# EAGLE schematic holo (EAGLE 6.1)

## Sheet 1 of 6
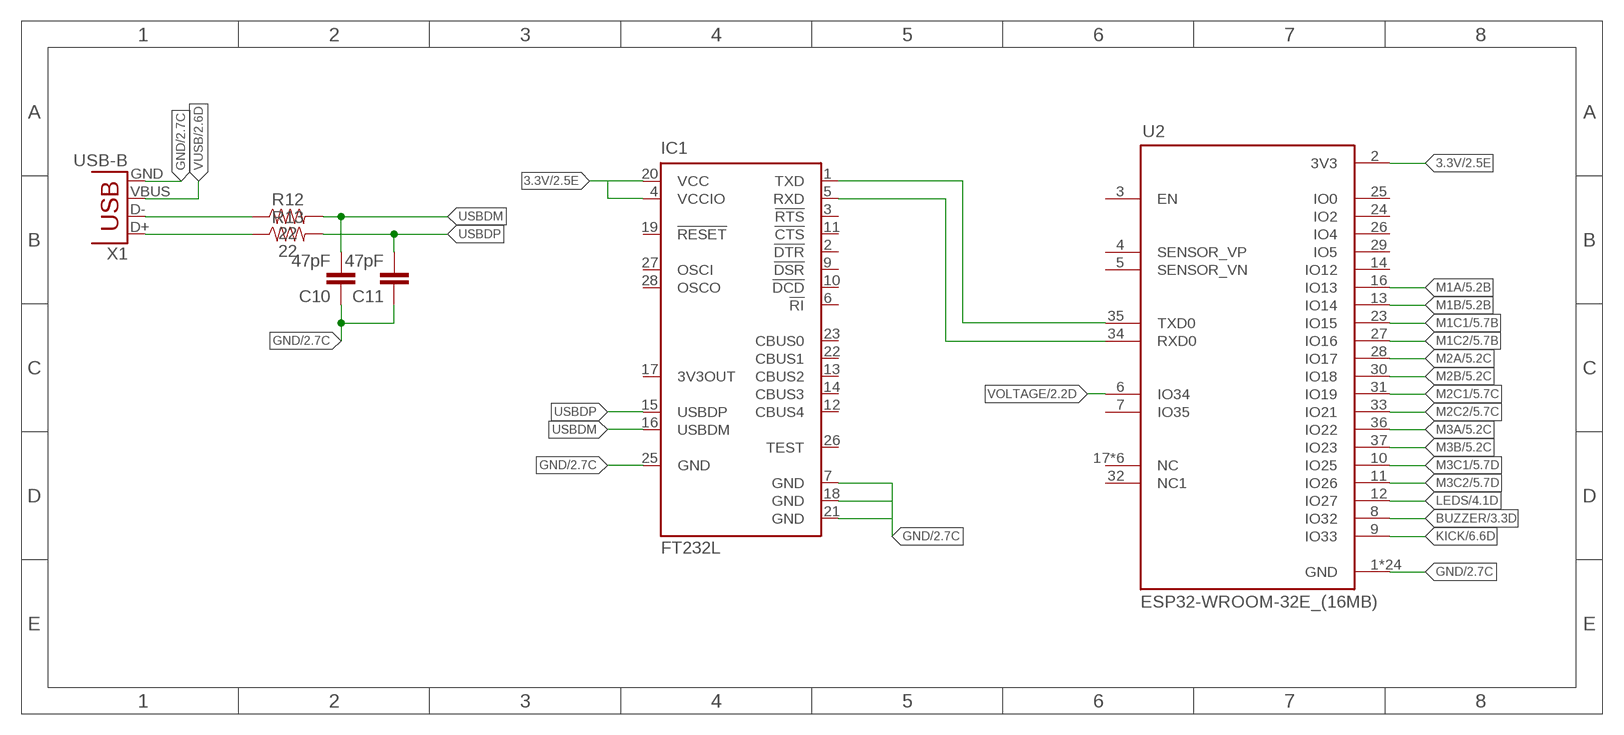
[diagram p0: schematic, sheet 1]

### Parts
C10  47pF  CAP0805  [0805]
C11  47pF  CAP0805  [0805]
IC1  FT232L  [SSOP28]
R12  22  0.3OHM-0805-1/8W-1%  [0805]
R13  22  0.3OHM-0805-1/8W-1%  [0805]
U2  ESP32-WROOM-32E_(16MB)  [MODULE_ESP32-WROOM-32E_(16MB)]
X1  USB-B  USBPTH  [USB-B-PTH]

### Nets
3.3V: IC1.4(VCCIO) IC1.20(VCC) U2.2(3V3) ; also sheet 2
BUZZER: U2.8(IO32) ; also sheet 3
GND [bigalime]: C10.1 C11.1 IC1.7(GND) IC1.18(GND) IC1.21(GND) IC1.25(GND) U2.1(GND) U2.15(GND) U2.38(GND) U2.39_1(GND) U2.39_2(GND) U2.39_3(GND) U2.39_4(GND) U2.39_5(GND) U2.39_6(GND) U2.39_7(GND) U2.39_8(GND) U2.39_9(GND) U2.39_10(GND) U2.39_11(GND) U2.39_12(GND) U2.39_13(GND) U2.39_14(GND) U2.39_15(GND) U2.39_16(GND) U2.39_17(GND) U2.39_18(GND) U2.39_19(GND) U2.39_20(GND) U2.39_21(GND) X1.GND ; also sheet 2,3,4,5,6
KICK: U2.9(IO33) ; also sheet 6
LEDS: U2.12(IO27) ; also sheet 4
M1A: U2.16(IO13) ; also sheet 5
M1B: U2.13(IO14) ; also sheet 5
M1C1: U2.23(IO15) ; also sheet 5
M1C2: U2.27(IO16) ; also sheet 5
M2A: U2.28(IO17) ; also sheet 5
M2B: U2.30(IO18) ; also sheet 5
M2C1: U2.31(IO19) ; also sheet 5
M2C2: U2.33(IO21) ; also sheet 5
M3A: U2.36(IO22) ; also sheet 5
M3B: U2.37(IO23) ; also sheet 5
M3C1: U2.10(IO25) ; also sheet 5
M3C2: U2.11(IO26) ; also sheet 5
N$14: IC1.1(TXD) U2.35(TXD0)
N$15: IC1.5(RXD) U2.34(RXD0)
N$59: R12.1 X1.D-
N$60: R13.1 X1.D+
USBDM: C10.2 IC1.16(USBDM) R12.2
USBDP: C11.2 IC1.15(USBDP) R13.2
VOLTAGE: U2.6(IO34) ; also sheet 2
VUSB: X1.VBUS ; also sheet 2
Unconnected: IC1.2(!DTR) IC1.3(!RTS) IC1.6(!RI) IC1.9(!DSR) IC1.10(!DCD) IC1.11(!CTS) IC1.12(CBUS4) IC1.13(CBUS2) IC1.14(CBUS3) IC1.17(3V3OUT) IC1.19(!RESET) IC1.22(CBUS1) IC1.23(CBUS0) IC1.26(TEST) IC1.27(OSCI) IC1.28(OSCO) U2.3(EN) U2.4(SENSOR_VP) U2.5(SENSOR_VN) U2.7(IO35) U2.14(IO12) U2.17(NC) U2.18(NC) U2.19(NC) U2.20(NC) U2.21(NC) U2.22(NC) U2.24(IO2) U2.25(IO0) U2.26(IO4) U2.29(IO5) U2.32(NC1)

## Sheet 2 of 6
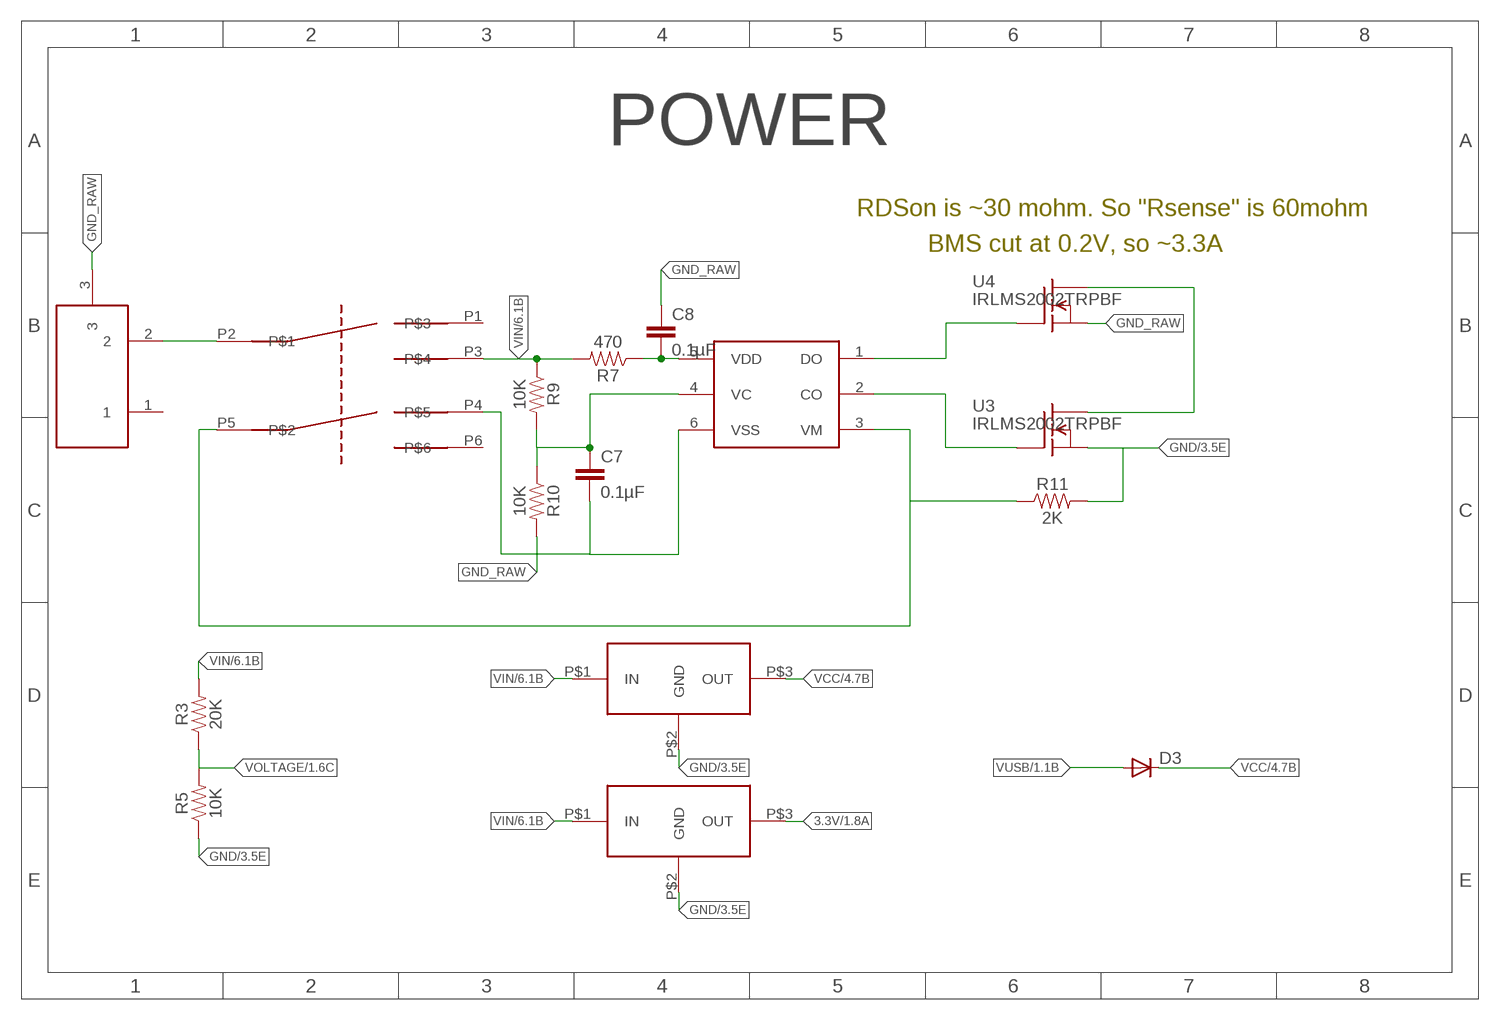
[diagram p1: schematic, sheet 2]

### Parts
C7  0.1µF  0.33UF/330NF-0805-50V-10%  [0805]
C8  0.1µF  0.33UF/330NF-0805-50V-10%  [0805]
D3  DIODESOD  [SOD-323]
R3  20K  0.3OHM-0805-1/8W-1%  [0805]
R5  10K  0.3OHM-0805-1/8W-1%  [0805]
R7  470  0.3OHM-0805-1/8W-1%  [0805]
R9  10K  0.3OHM-0805-1/8W-1%  [0805]
R10  10K  0.3OHM-0805-1/8W-1%  [0805]
R11  2K  0.3OHM-0805-1/8W-1%  [0805]
REG  REG_5V  [TRACOPOWER]
REG1  REG_5V  [TRACOPOWER]
U3  IRLMS2002TRPBF  [SOT23-6]
U4  IRLMS2002TRPBF  [SOT23-6]
U$7  S8252  [SOT23-6]
U$14  DPDT  [L202021MA04Q]
X2  DC21MMX  [DC-21MM]

### Nets
3.3V: REG1.P$3(OUT) ; also sheet 1
GND [bigalime]: R5.1 R11.2 REG1.P$2(GND) REG.P$2(GND) U3.4(S) ; also sheet 1,3,4,5,6
GND_RAW [bigalime]: C7.2 C8.1 R10.2 U4.4(S) U$7.6(VSS) U$14.P4 X2.3
N$7: U$14.P2 X2.2
N$8: C8.2 R7.1 U$7.5(VDD)
N$9: C7.1 R9.2 R10.1 U$7.4(VC)
N$10: U3.1(D) U3.2(D) U3.5(D) U3.6(D) U4.1(D) U4.2(D) U4.5(D) U4.6(D)
N$11: U3.3(G) U$7.2(CO)
N$12: U4.3(G) U$7.1(DO)
N$13: R11.1 U$7.3(VM) U$14.P5
VCC [alime]: D3.1(C) REG.P$3(OUT) ; also sheet 4
VIN [alime]: R3.2 R7.2 R9.1 REG1.P$1(IN) REG.P$1(IN) U$14.P3 ; also sheet 6
VOLTAGE: R3.1 R5.2 ; also sheet 1
VUSB: D3.2(A) ; also sheet 1
Unconnected: U$14.P1 U$14.P6

### Notes on the sheet
- POWER
- RDSon is ~30 mohm. So "Rsense" is 60mohm
- BMS cut at 0.2V, so ~3.3A

## Sheet 3 of 6
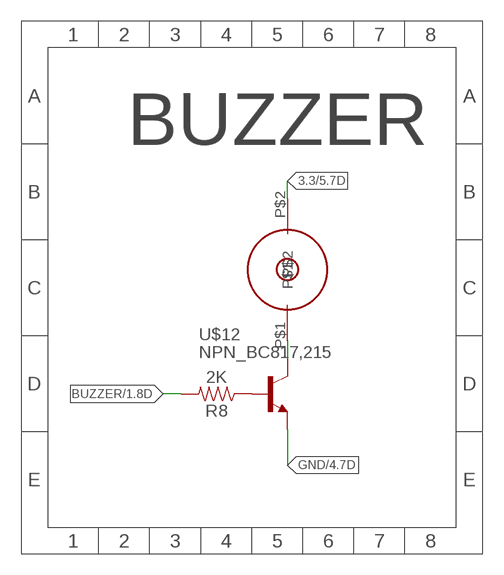
[diagram p2: schematic, sheet 3]

### Parts
R8  2K  0.3OHM-0805-1/8W-1%  [0805]
U$12  NPN_BC817,215  [SOT-23]
U$13  BUZZER66  [BUZZER66]

### Nets
3.3: U$13.P$2 ; also sheet 5
BUZZER: R8.2 ; also sheet 1
GND [bigalime]: U$12.2(E) ; also sheet 1,2,4,5,6
N$3: R8.1 U$12.1(B)
N$5: U$12.3(C) U$13.P$1

### Notes on the sheet
- BUZZER

## Sheet 4 of 6
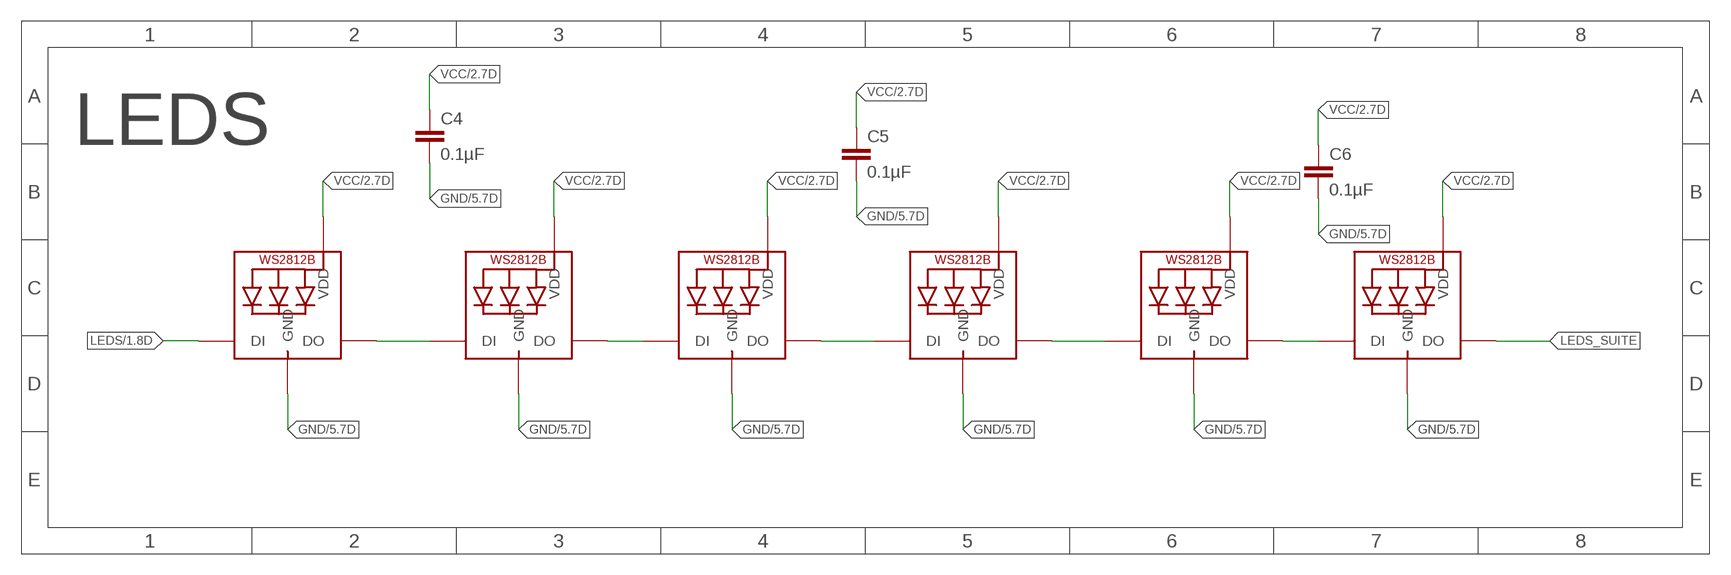
[diagram p3: schematic, sheet 4]

### Parts
C4  0.1µF  0.33UF/330NF-0805-50V-10%  [0805]
C5  0.1µF  0.33UF/330NF-0805-50V-10%  [0805]
C6  0.1µF  0.33UF/330NF-0805-50V-10%  [0805]
LED1  WS2812B5050  [WS2812B]
LED2  WS2812B5050  [WS2812B]
LED3  WS2812B5050  [WS2812B]
LED4  WS2812B5050  [WS2812B]
LED5  WS2812B5050  [WS2812B]
LED6  WS2812B5050  [WS2812B]

### Nets
GND [bigalime]: C4.2 C5.2 C6.2 LED1.3-GND(GND) LED2.3-GND(GND) LED3.3-GND(GND) LED4.3-GND(GND) LED5.3-GND(GND) LED6.3-GND(GND) ; also sheet 1,2,3,5,6
LEDS: LED1.4-DIN(DI) ; also sheet 1
LEDS_SUITE: LED6.2-DOUT(DO)
N$27: LED1.2-DOUT(DO) LED2.4-DIN(DI)
N$28: LED2.2-DOUT(DO) LED3.4-DIN(DI)
N$30: LED4.2-DOUT(DO) LED5.4-DIN(DI)
N$32: LED5.2-DOUT(DO) LED6.4-DIN(DI)
N$39: LED3.2-DOUT(DO) LED4.4-DIN(DI)
VCC [alime]: C4.1 C5.1 C6.1 LED1.1-VDD(VDD) LED2.1-VDD(VDD) LED3.1-VDD(VDD) LED4.1-VDD(VDD) LED5.1-VDD(VDD) LED6.1-VDD(VDD) ; also sheet 2

### Notes on the sheet
- LEDS

## Sheet 5 of 6
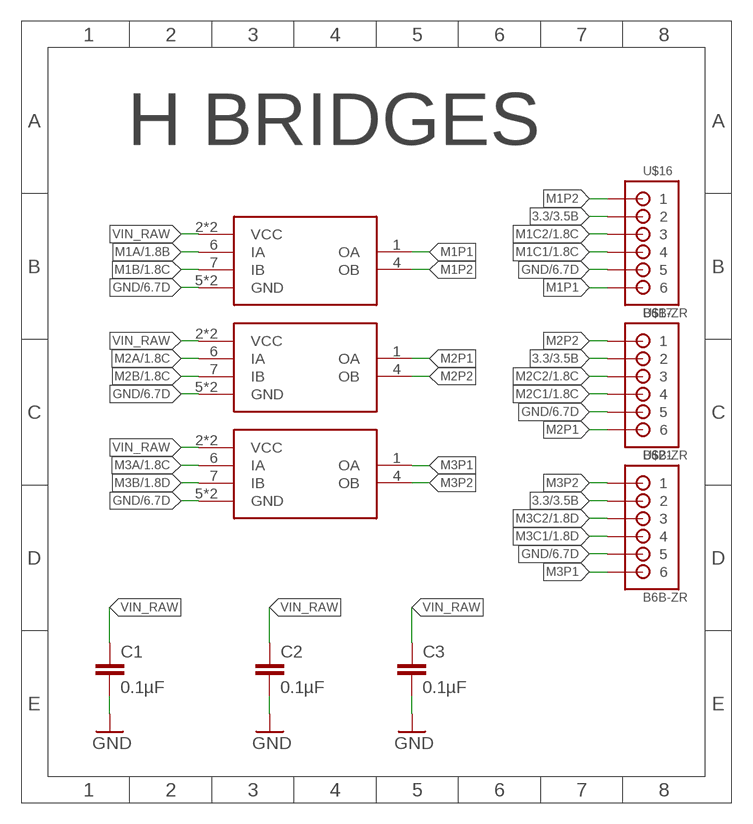
[diagram p4: schematic, sheet 5]

### Parts
C1  0.1µF  0.33UF/330NF-0805-50V-10%  [0805]
C2  0.1µF  0.33UF/330NF-0805-50V-10%  [0805]
C3  0.1µF  0.33UF/330NF-0805-50V-10%  [0805]
HB1  L9110  [SO8]
HB2  L9110  [SO8]
HB3  L9110  [SO8]
U$16  B6B-ZR  [B6B-ZR]
U$17  B6B-ZR  [B6B-ZR]
U$21  B6B-ZR  [B6B-ZR]

### Nets
3.3: U$16.2 U$17.2 U$21.2 ; also sheet 3
GND [bigalime]: C1.2 C2.2 C3.2 HB1.5(GND) HB1.8(GND) HB2.5(GND) HB2.8(GND) HB3.5(GND) HB3.8(GND) U$16.5 U$17.5 U$21.5 ; also sheet 1,2,3,4,6
M1A: HB1.6(IA) ; also sheet 1
M1B: HB1.7(IB) ; also sheet 1
M1C1: U$16.4 ; also sheet 1
M1C2: U$16.3 ; also sheet 1
M1P1 [bigalime]: HB1.1(OA) U$16.6
M1P2 [bigalime]: HB1.4(OB) U$16.1
M2A: HB2.6(IA) ; also sheet 1
M2B: HB2.7(IB) ; also sheet 1
M2C1: U$17.4 ; also sheet 1
M2C2: U$17.3 ; also sheet 1
M2P1 [bigalime]: HB2.1(OA) U$17.6
M2P2 [bigalime]: HB2.4(OB) U$17.1
M3A: HB3.6(IA) ; also sheet 1
M3B: HB3.7(IB) ; also sheet 1
M3C1: U$21.4 ; also sheet 1
M3C2: U$21.3 ; also sheet 1
M3P1 [bigalime]: HB3.1(OA) U$21.6
M3P2 [bigalime]: HB3.4(OB) U$21.1
VIN_RAW [bigalime]: C1.1 C2.1 C3.1 HB1.2(VCC) HB1.3(VCC) HB2.2(VCC) HB2.3(VCC) HB3.2(VCC) HB3.3(VCC)

### Notes on the sheet
- H BRIDGES

## Sheet 6 of 6
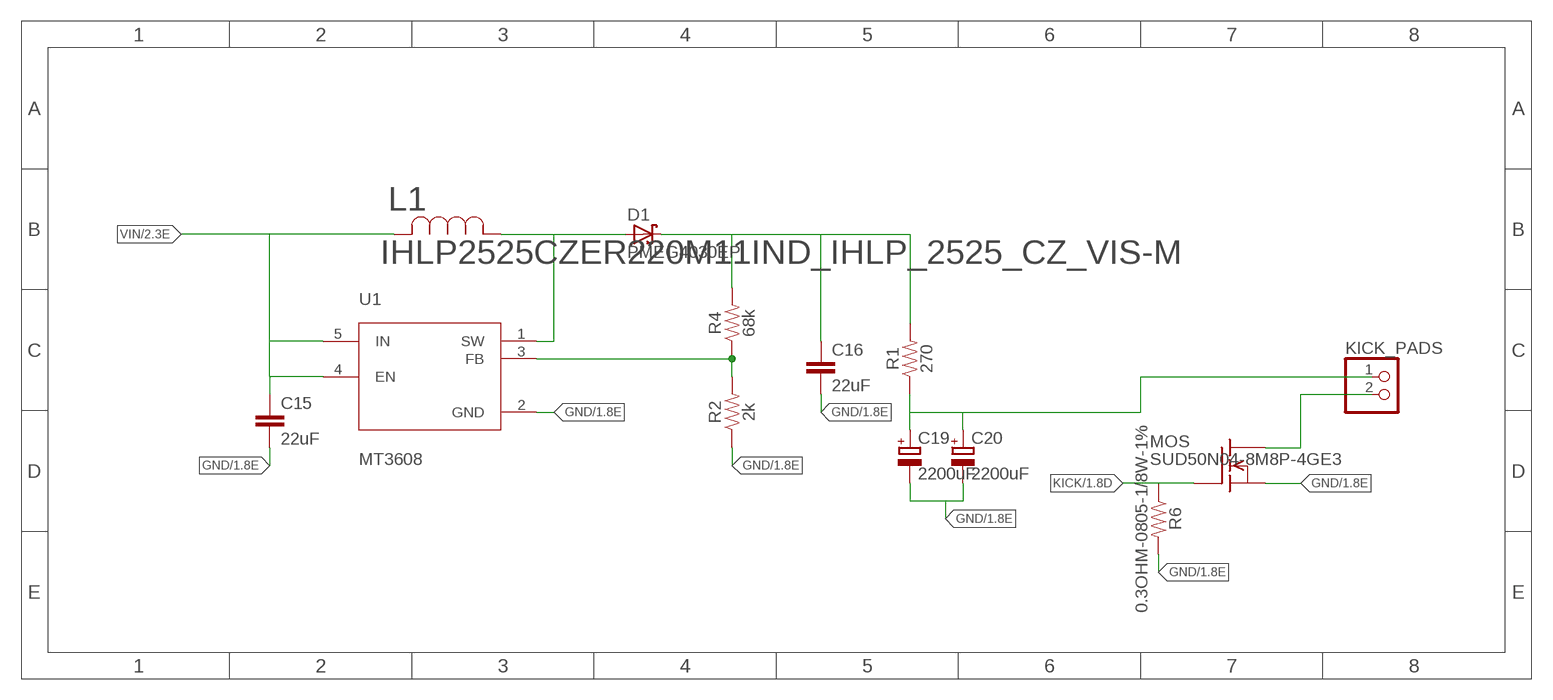
[diagram p5: schematic, sheet 6]

### Parts
C15  22uF  C-EUC0805  [C0805]
C16  22uF  C-EUC0805  [C0805]
C19  2200uF  CPOL-EUE5-13  [E5-13]
C20  2200uF  CPOL-EUE5-13  [E5-13]
D1  PMEG4030EP  [SOD128]
KICK_PADS  KICKER  [KICKER]
L1  IHLP2525CZER220M11IND_IHLP_2525_CZ_VIS-M  [IND_IHLP_2525_CZ_VIS-M]
MOS  SUD50N04-8M8P-4GE3  [TO252]
R1  270  0.3OHM-0805-1/8W-1%  [0805]
R2  2k  0.3OHM-0805-1/8W-1%  [0805]
R4  68k  0.3OHM-0805-1/8W-1%  [0805]
R6  0.3OHM-0805-1/8W-1%  [0805]
U1  MT3608  [SOT95P280X145-6N]

### Nets
GND [bigalime]: C15.2 C16.2 C19.- C20.- MOS.2(S) R2.1 R6.2 U1.2(GND) ; also sheet 1,2,3,4,5
KICK: MOS.1(G) R6.1 ; also sheet 1
KICKER: KICK_PADS.2 MOS.3(D)
N$1: D1.2(A) L1.1 U1.1(SW)
N$2: C16.1 D1.1(K) R1.2 R4.2
N$4: R2.2 R4.1 U1.3(FB)
VIN [alime]: C15.1 L1.2 U1.4(EN) U1.5(IN) ; also sheet 2
VSTORE: C19.+ C20.+ KICK_PADS.1 R1.1

## Power pins joined to a net without a drawn wire
1: X2.1

## Library data of the parts
C1-C8 = SparkFun-Capacitors:0.33UF/330NF: 0.33µF/330nF ceramic capacitors A capacitor is a passive two-terminal electrical component used to store electrical energy temporarily in an electric field.; FARNELL: 2688486RL; PROD_ID: CAP-08469; VALUE: 0.33µF
C10 C11 = SparkFun-Passives:CAP: Capacitor Standard 0603 ceramic capacitor, and 0.1" leaded capacitor.; FARNELL: 1081223
C15 C16 = resistor:C-EU: CAPACITOR, European symbol; FARNELL: 2666560
C19 C20 = rcl:CPOL-EU: POLARIZED CAPACITOR, European symbol; FARNELL: 1902893
D1 = nxp_60:PMEG4030E: 40 V, 3 A low VF MEGA Schottky barrier rectifier Planar Maximum Efficiency General Application (MEGA) Schottky barrier rectifier with an integrated guard ring for stress protection. AAL Eindhoven MK; FARNELL: 1829201
D3 = SparkFun-DiscreteSemi:DIODE: Diode These are standard reverse protection diodes and small signal diodes. SMA package can handle up to about 1A. SOD-323 can handle about 200mA. What the SOD-323 package when ordering, there are some mfgs out there that are 5-pin packages.; FARNELL: 8737843RL
HB1-HB3 = rhoban:L9110; FARNELL: L9110 SOIC8
IC1 = rhoban:FT232: Source: http://www.ftdichip.com/Documents/DataSheets/DS_FT232R_v104.pdf; DATASHEET: ft232rl.pdf; FARNELL: 1146032; FARNELL_LINK: http://fr.farnell.com/ftdi/ft232rl/usb-vers-uart-cms-ssop28-232/dp/1146032?Ntt=1146032; MPN: FT232RL; OC_FARNELL: 1146032; OC_NEWARK: 91K9918
KICK_PADS = rhoban:KICKER
L1 = INDUCTOR:IHLP2525CZER220M11; BUILT_BY: EMA_UL_Team; FARNELL: 1741369; MANUFACTURER_PART_NUMBER: IHLP2525CZER220M11; SOURCELIBRARY: Vishay_2020-02-10; VENDOR: Vishay
LED1-LED6 = adafruit:WS2812B; FARNELL: WS2812B 5050
MOS = rhoban:SUD50N04-8M8P-4GE3; FARNELL: 1794799
R1 = SparkFun-Resistors:0.3OHM: 0.3Ω resistor A resistor is a passive two-terminal electrical component that implements electrical resistance as a circuit element. Resistors act to reduce current flow, and, at the same time, act to lower voltage levels within circuits. - Wikipedia; FARNELL: 1887603; PROD_ID: RES-11622; VALUE: 0.3
R2 = SparkFun-Resistors:0.3OHM: 0.3Ω resistor A resistor is a passive two-terminal electrical component that implements electrical resistance as a circuit element. Resistors act to reduce current flow, and, at the same time, act to lower voltage levels within circuits. - Wikipedia; FARNELL: MCWR08X2001FTL; PROD_ID: RES-11622; VALUE: 0.3
R3 = SparkFun-Resistors:0.3OHM: 0.3Ω resistor A resistor is a passive two-terminal electrical component that implements electrical resistance as a circuit element. Resistors act to reduce current flow, and, at the same time, act to lower voltage levels within circuits. - Wikipedia; FARNELL: 2074395; PROD_ID: RES-11622; VALUE: 0.3
R4 = SparkFun-Resistors:0.3OHM: 0.3Ω resistor A resistor is a passive two-terminal electrical component that implements electrical resistance as a circuit element. Resistors act to reduce current flow, and, at the same time, act to lower voltage levels within circuits. - Wikipedia; FARNELL: 2447023; PROD_ID: RES-11622; VALUE: 0.3
R5 R9 R10 = SparkFun-Resistors:0.3OHM: 0.3Ω resistor A resistor is a passive two-terminal electrical component that implements electrical resistance as a circuit element. Resistors act to reduce current flow, and, at the same time, act to lower voltage levels within circuits. - Wikipedia; FARNELL: 2074334RL; PROD_ID: RES-11622; VALUE: 0.3
R6 = SparkFun-Resistors:0.3OHM: 0.3Ω resistor A resistor is a passive two-terminal electrical component that implements electrical resistance as a circuit element. Resistors act to reduce current flow, and, at the same time, act to lower voltage levels within circuits. - Wikipedia; FARNELL: 2447648; PROD_ID: RES-11622; VALUE: 0.3
R7 = SparkFun-Resistors:0.3OHM: 0.3Ω resistor A resistor is a passive two-terminal electrical component that implements electrical resistance as a circuit element. Resistors act to reduce current flow, and, at the same time, act to lower voltage levels within circuits. - Wikipedia; FARNELL: 2447662; PROD_ID: RES-11622; VALUE: 0.3
R8 R11 = SparkFun-Resistors:0.3OHM: 0.3Ω resistor A resistor is a passive two-terminal electrical component that implements electrical resistance as a circuit element. Resistors act to reduce current flow, and, at the same time, act to lower voltage levels within circuits. - Wikipedia; FARNELL: 2447622; PROD_ID: RES-11622; VALUE: 0.3
R12 R13 = SparkFun-Resistors:0.3OHM: 0.3Ω resistor A resistor is a passive two-terminal electrical component that implements electrical resistance as a circuit element. Resistors act to reduce current flow, and, at the same time, act to lower voltage levels within circuits. - Wikipedia; FARNELL: 2446926; PROD_ID: RES-11622; VALUE: 0.3
REG REG1 = rhoban:REG_5V; FARNELL: 1696320
U1 = MT3608:MT3608: High Efficiency 1.2MHz 2A Step Up Converter Check prices <https://pricing.snapeda.com/parts/MT3608/Aerosemi%20Technology%20Co.%2C%20Ltd/view-part?ref=eda>; AVAILABILITY: No availability data; DESCRIPTION: High Efficiency 1.2MHz 2A Step Up Converter; FARNELL: MT3608; MF: Aerosemi Technology Co., Ltd; MP: MT3608; PACKAGE: Package; PRICE: None
U2 = ESP32-WROOM-32E__16MB_:ESP32-WROOM-32E_(16MB): Bluetooth, WiFi 802.11b/g/n, Bluetooth v4.2 +EDR, Class 1, 2 and 3 Transceiver Module 2.4GHz ~ 2.5GHz Integrated, Trace Surface Mount Check availability <https://pricing.snapeda.com/parts/ESP32-WROOM-32E%20%2816MB%29/Espressif%20Systems/view-part?ref=eda>; AVAILABILITY: In Stock; DESCRIPTION: Bluetooth, WiFi 802.11b/g/n, Bluetooth v4.2 +EDR, Class 1, 2 and 3 Transceiver Module 2.4GHz ~ 2.5GHz Integrated, Trace Surface Mount; MF: Espressif Systems; MP: ESP32-WROOM-32E (16MB); PACKAGE: SMD-44 Espressif Systems; PRICE: None
U3 U4 = rhoban:IRLMS2002TRPBF; FARNELL: 2577180RL
U$7 = rhoban:S8252; FARNELL: https://www.digikey.fr/fr/products/detail/ablic-u-s-a-inc/S-8252AAL-M6T1U/6121452; REF: S-8252AAL-M6T1U
U$12 = rhoban:NPN; FARNELL: 1081223
U$13 = rhoban:BUZZER; FARNELL: CEM-1203
U$14 = rhoban:DPDT; FARNELL: 2435159
U$16 U$17 U$21 = jst:B6B-ZR: JST-ZH Connector 6 pol, 1.5mm pitch Package: B6B-ZR Source: http://www.jst-mfg.com/product/pdf/eng/eZH.pdf; FARNELL: 9491805
X1 = SparkFun-Connectors:USB: USB Connectors USB-B-PTH is fully proven SKU : PRT-00139/CONN-08278 USB-miniB is fully proven SKU : PRT-00587 USB-A-PCB is untested. USB-A-H is throughly reviewed, but untested. Spark Fun Electronics SKU : PRT-00437 USB-B-SMT is throughly reviewed, but untested. Needs silkscreen touching up. USB-A-S has not been used/tested USB-MB-H has not been used/tested USB-MICROB has been used. CONN-09505; FARNELL: 1308876; PROD_ID: CONN-08278
X2 = powersupply:DC21MM; FARNELL: 1217037

## Net classes
0 default: width 0.203 mm
1 alime: width 0.254 mm
2 bigalime: width 0.381 mm